# Altium schematic sheet Block Diagram.SchDoc
size A3; SheetNumber: 1; SheetTotal: 15
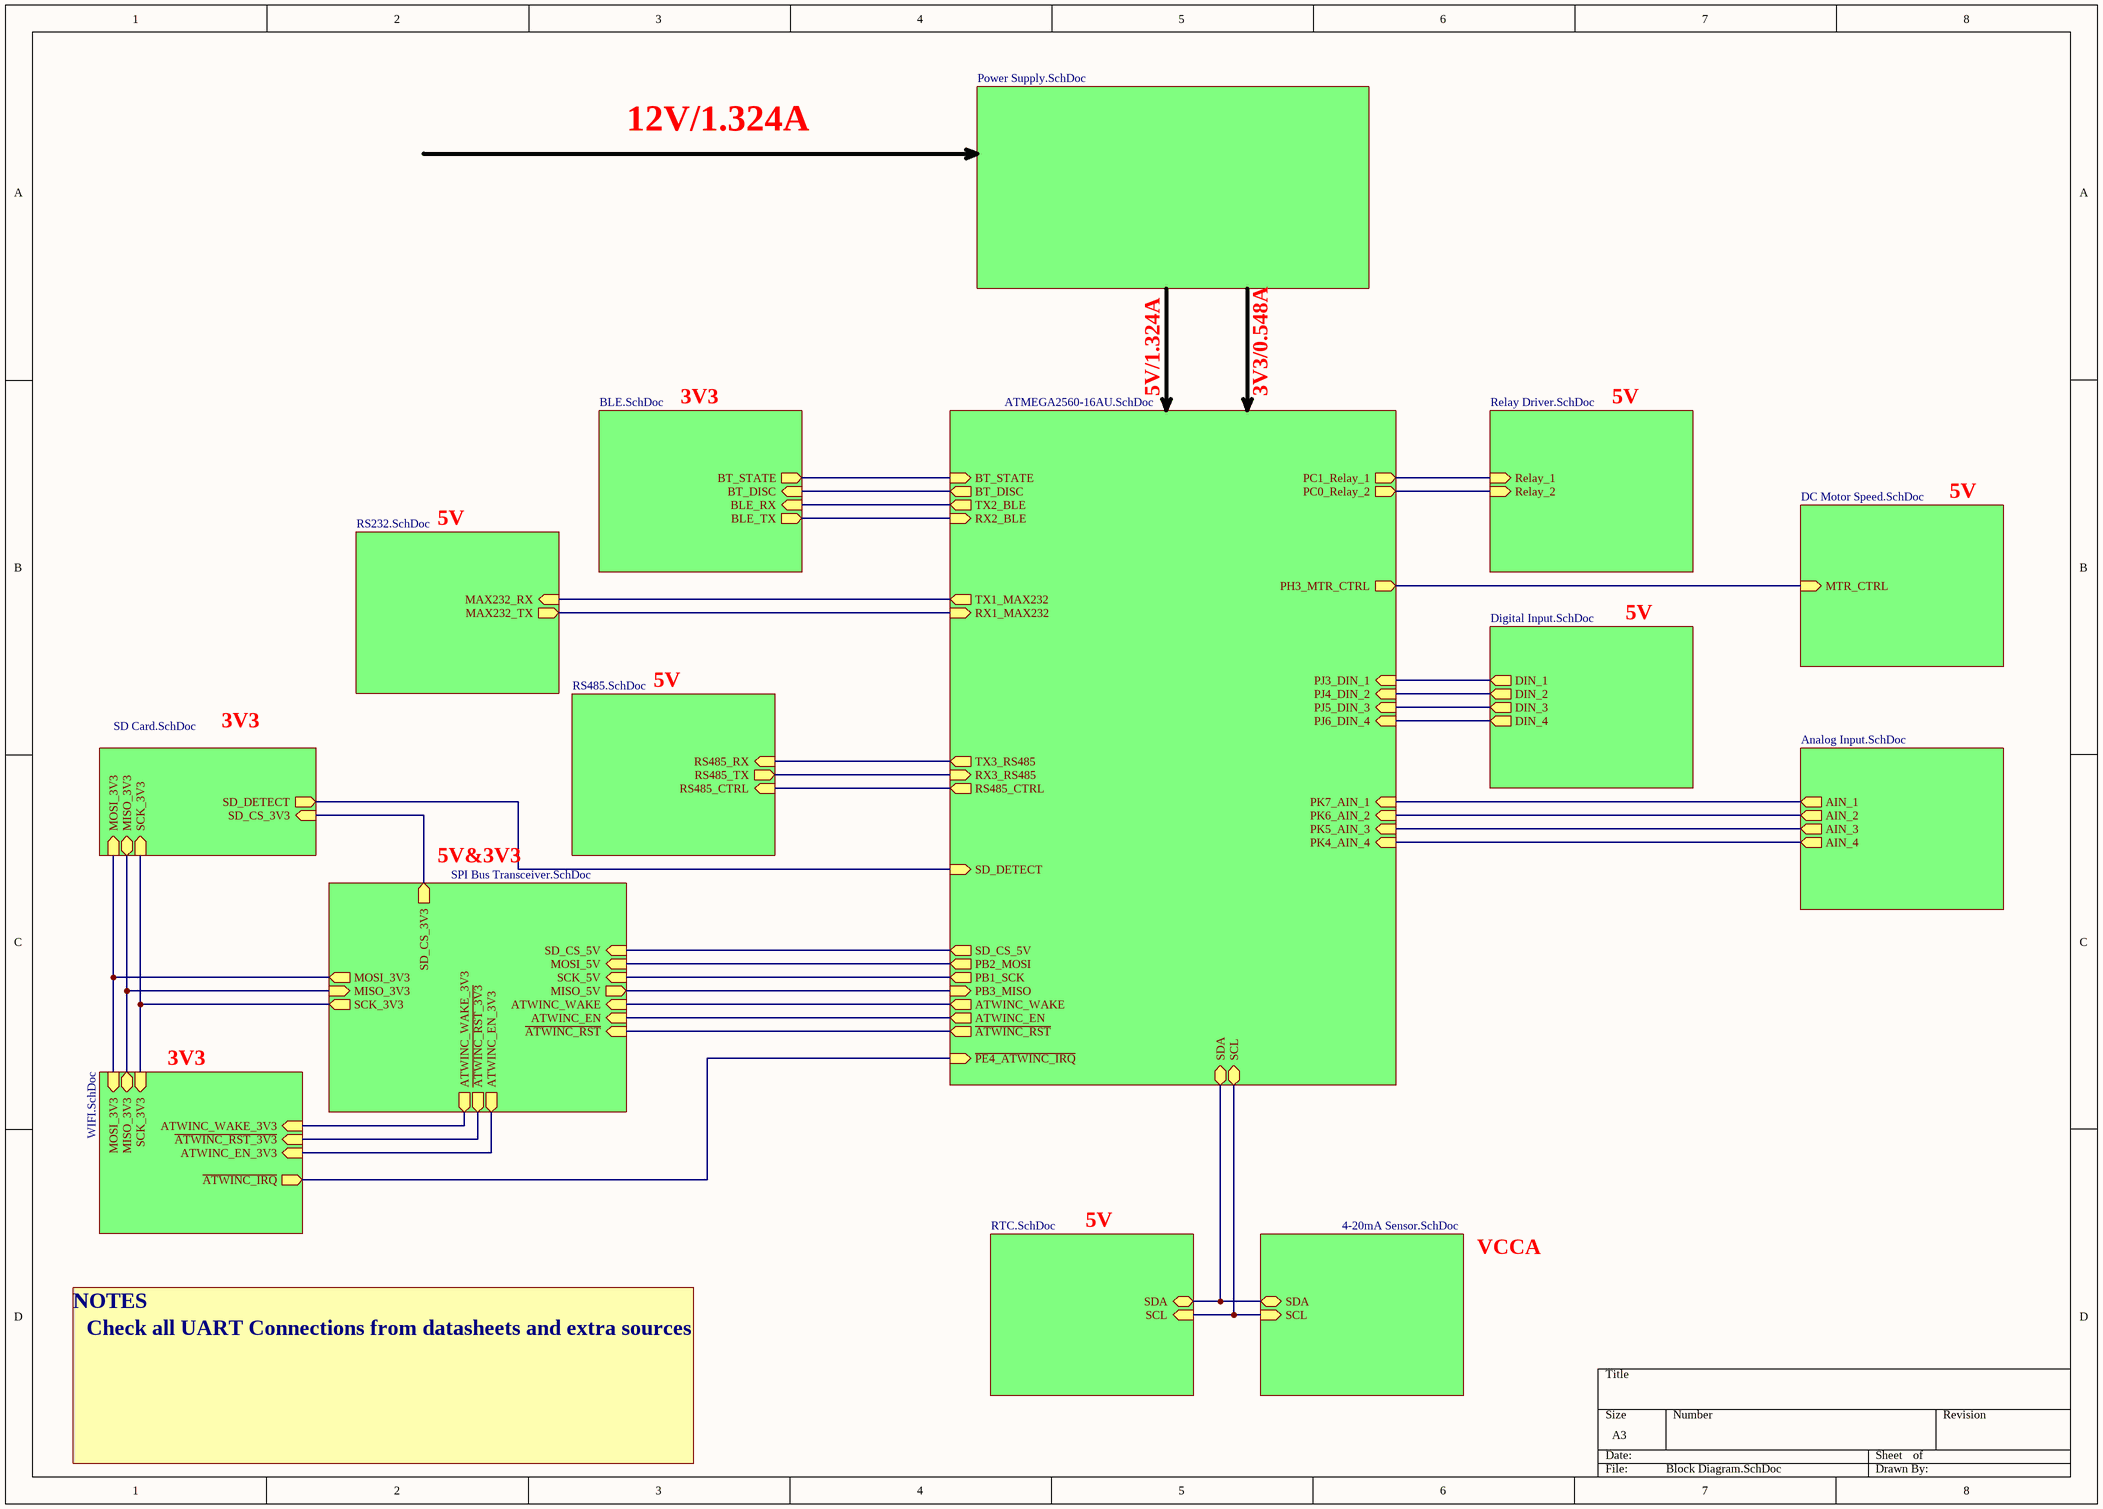
[diagram p0: Block Diagram.SchDoc]

## Sub-sheets
4-20mA Sensor = 4-20mA Sensor.SchDoc: SCL (in), SDA (bidir)
Analog Input = Analog Input.SchDoc: AIN_1 (out), AIN_2 (out), AIN_3 (out), AIN_4 (out)
ATMEGA2560-16AU = ATMEGA2560-16AU.SchDoc: PC1_Relay_1 (out), PC0_Relay_2 (out), PH3_MTR_CTRL (out), PJ3_DIN_1 (in), PJ4_DIN_2 (in), PJ5_DIN_3 (in), PJ6_DIN_4 (in), PK7_AIN_1 (in), PK6_AIN_2 (in), PK5_AIN_3 (in), PK4_AIN_4 (in), SCL (bidir), SDA (bidir), RX2_BLE (in), TX2_BLE (out), BT_STATE (in), BT_DISC (out), SD_CS_5V (out), PB2_MOSI (out), PB1_SCK (out), SD_DETECT (in), PB3_MISO (in), RS485_CTRL (out), ATWINC_WAKE (out), ATWINC_EN (out), TX1_MAX232 (out), RX1_MAX232 (in), RX3_RS485 (in), TX3_RS485 (out), ~{ATWINC_RST} (out), ~{PE4_ATWINC_IRQ} (in)
BLE = BLE.SchDoc: BT_STATE (out), BT_DISC (in), BLE_RX (in), BLE_TX (out)
DC Motor Speed = DC Motor Speed.SchDoc: MTR_CTRL (in)
Digital Input = Digital Input.SchDoc: DIN_1 (out), DIN_2 (out), DIN_3 (out), DIN_4 (out)
Power Supply = Power Supply.SchDoc: no entries
Relay Driver = Relay Driver.SchDoc: Relay_1 (in), Relay_2 (in)
RS232 = RS232.SchDoc: MAX232_RX (in), MAX232_TX (out)
RS485 = RS485.SchDoc: RS485_RX (in), RS485_TX (out), RS485_CTRL (in)
RTC = RTC.SchDoc: SCL (in), SDA (bidir)
SD Card = SD Card.SchDoc: SD_DETECT (out), MISO_3V3 (bidir), SCK_3V3 (in), MOSI_3V3 (in), SD_CS_3V3 (in)
SPI Bus Transceiver = SPI Bus Transceiver.SchDoc: SD_CS_5V (in), MOSI_5V (in), SCK_5V (in), SCK_3V3 (out), MOSI_3V3 (out), ATWINC_EN_3V3 (out), ~{ATWINC_RST_3V3} (out), ATWINC_WAKE (in), ATWINC_EN (in), MISO_5V (out), MISO_3V3 (in), SD_CS_3V3 (out), ATWINC_WAKE_3V3 (out), ~{ATWINC_RST} (in)
WIFI = WIFI.SchDoc: MOSI_3V3 (in), MISO_3V3 (bidir), SCK_3V3 (in), ~{ATWINC_IRQ} (out), ~{ATWINC_RST_3V3} (in), ATWINC_EN_3V3 (in), ATWINC_WAKE_3V3 (in)

## Nets
(unnamed): sheet ATMEGA2560-16AU/PC1_Relay_1, sheet Relay Driver/Relay_1
(unnamed): sheet ATMEGA2560-16AU/PC0_Relay_2, sheet Relay Driver/Relay_2
(unnamed): sheet ATMEGA2560-16AU/PH3_MTR_CTRL, sheet DC Motor Speed/MTR_CTRL
(unnamed): sheet ATMEGA2560-16AU/PJ3_DIN_1, sheet Digital Input/DIN_1
(unnamed): sheet ATMEGA2560-16AU/PJ4_DIN_2, sheet Digital Input/DIN_2
(unnamed): sheet ATMEGA2560-16AU/PJ5_DIN_3, sheet Digital Input/DIN_3
(unnamed): sheet ATMEGA2560-16AU/PJ6_DIN_4, sheet Digital Input/DIN_4
(unnamed): sheet ATMEGA2560-16AU/PK7_AIN_1, sheet Analog Input/AIN_1
(unnamed): sheet ATMEGA2560-16AU/PK6_AIN_2, sheet Analog Input/AIN_2
(unnamed): sheet ATMEGA2560-16AU/PK5_AIN_3, sheet Analog Input/AIN_3
(unnamed): sheet ATMEGA2560-16AU/PK4_AIN_4, sheet Analog Input/AIN_4
(unnamed): sheet ATMEGA2560-16AU/SCL, sheet 4-20mA Sensor/SCL, sheet RTC/SCL
(unnamed): sheet ATMEGA2560-16AU/SDA, sheet 4-20mA Sensor/SDA, sheet RTC/SDA
(unnamed): sheet ATMEGA2560-16AU/RX2_BLE, sheet BLE/BLE_TX
(unnamed): sheet ATMEGA2560-16AU/TX2_BLE, sheet BLE/BLE_RX
(unnamed): sheet ATMEGA2560-16AU/BT_STATE, sheet BLE/BT_STATE
(unnamed): sheet ATMEGA2560-16AU/BT_DISC, sheet BLE/BT_DISC
(unnamed): sheet ATMEGA2560-16AU/SD_CS_5V, sheet SPI Bus Transceiver/SD_CS_5V
(unnamed): sheet ATMEGA2560-16AU/PB2_MOSI, sheet SPI Bus Transceiver/MOSI_5V
(unnamed): sheet ATMEGA2560-16AU/PB1_SCK, sheet SPI Bus Transceiver/SCK_5V
(unnamed): sheet ATMEGA2560-16AU/SD_DETECT, sheet SD Card/SD_DETECT
(unnamed): sheet ATMEGA2560-16AU/PB3_MISO, sheet SPI Bus Transceiver/MISO_5V
(unnamed): sheet ATMEGA2560-16AU/RS485_CTRL, sheet RS485/RS485_CTRL
(unnamed): sheet ATMEGA2560-16AU/ATWINC_WAKE, sheet SPI Bus Transceiver/ATWINC_WAKE
(unnamed): sheet ATMEGA2560-16AU/ATWINC_EN, sheet SPI Bus Transceiver/ATWINC_EN
(unnamed): sheet ATMEGA2560-16AU/TX1_MAX232, sheet RS232/MAX232_RX
(unnamed): sheet ATMEGA2560-16AU/RX1_MAX232, sheet RS232/MAX232_TX
(unnamed): sheet ATMEGA2560-16AU/RX3_RS485, sheet RS485/RS485_TX
(unnamed): sheet ATMEGA2560-16AU/TX3_RS485, sheet RS485/RS485_RX
(unnamed): sheet ATMEGA2560-16AU/~{ATWINC_RST}, sheet SPI Bus Transceiver/~{ATWINC_RST}
(unnamed): sheet ATMEGA2560-16AU/~{PE4_ATWINC_IRQ}, sheet WIFI/~{ATWINC_IRQ}
(unnamed): sheet WIFI/MOSI_3V3, sheet SD Card/MOSI_3V3, sheet SPI Bus Transceiver/MOSI_3V3
(unnamed): sheet WIFI/MISO_3V3, sheet SD Card/MISO_3V3, sheet SPI Bus Transceiver/MISO_3V3
(unnamed): sheet WIFI/SCK_3V3, sheet SD Card/SCK_3V3, sheet SPI Bus Transceiver/SCK_3V3
(unnamed): sheet WIFI/~{ATWINC_RST_3V3}, sheet SPI Bus Transceiver/~{ATWINC_RST_3V3}
(unnamed): sheet WIFI/ATWINC_EN_3V3, sheet SPI Bus Transceiver/ATWINC_EN_3V3
(unnamed): sheet WIFI/ATWINC_WAKE_3V3, sheet SPI Bus Transceiver/ATWINC_WAKE_3V3
(unnamed): sheet SD Card/SD_CS_3V3, sheet SPI Bus Transceiver/SD_CS_3V3

## Notes on the sheet
- 12V/1.324A
- 3V3
- 5V/1.324A
- 3V3/0.548A
- 5V
- 5V&3V3
- VCCA
- NOTES
- Check all UART Connections from datasheets and extra sources